# Altium schematic sheet WDT_TASTERI_M_S.SchDoc: ATLAS_XP2V5
size 558 x 431 mm; Organization: IMP Automatika d.o.o.; Revision: V5
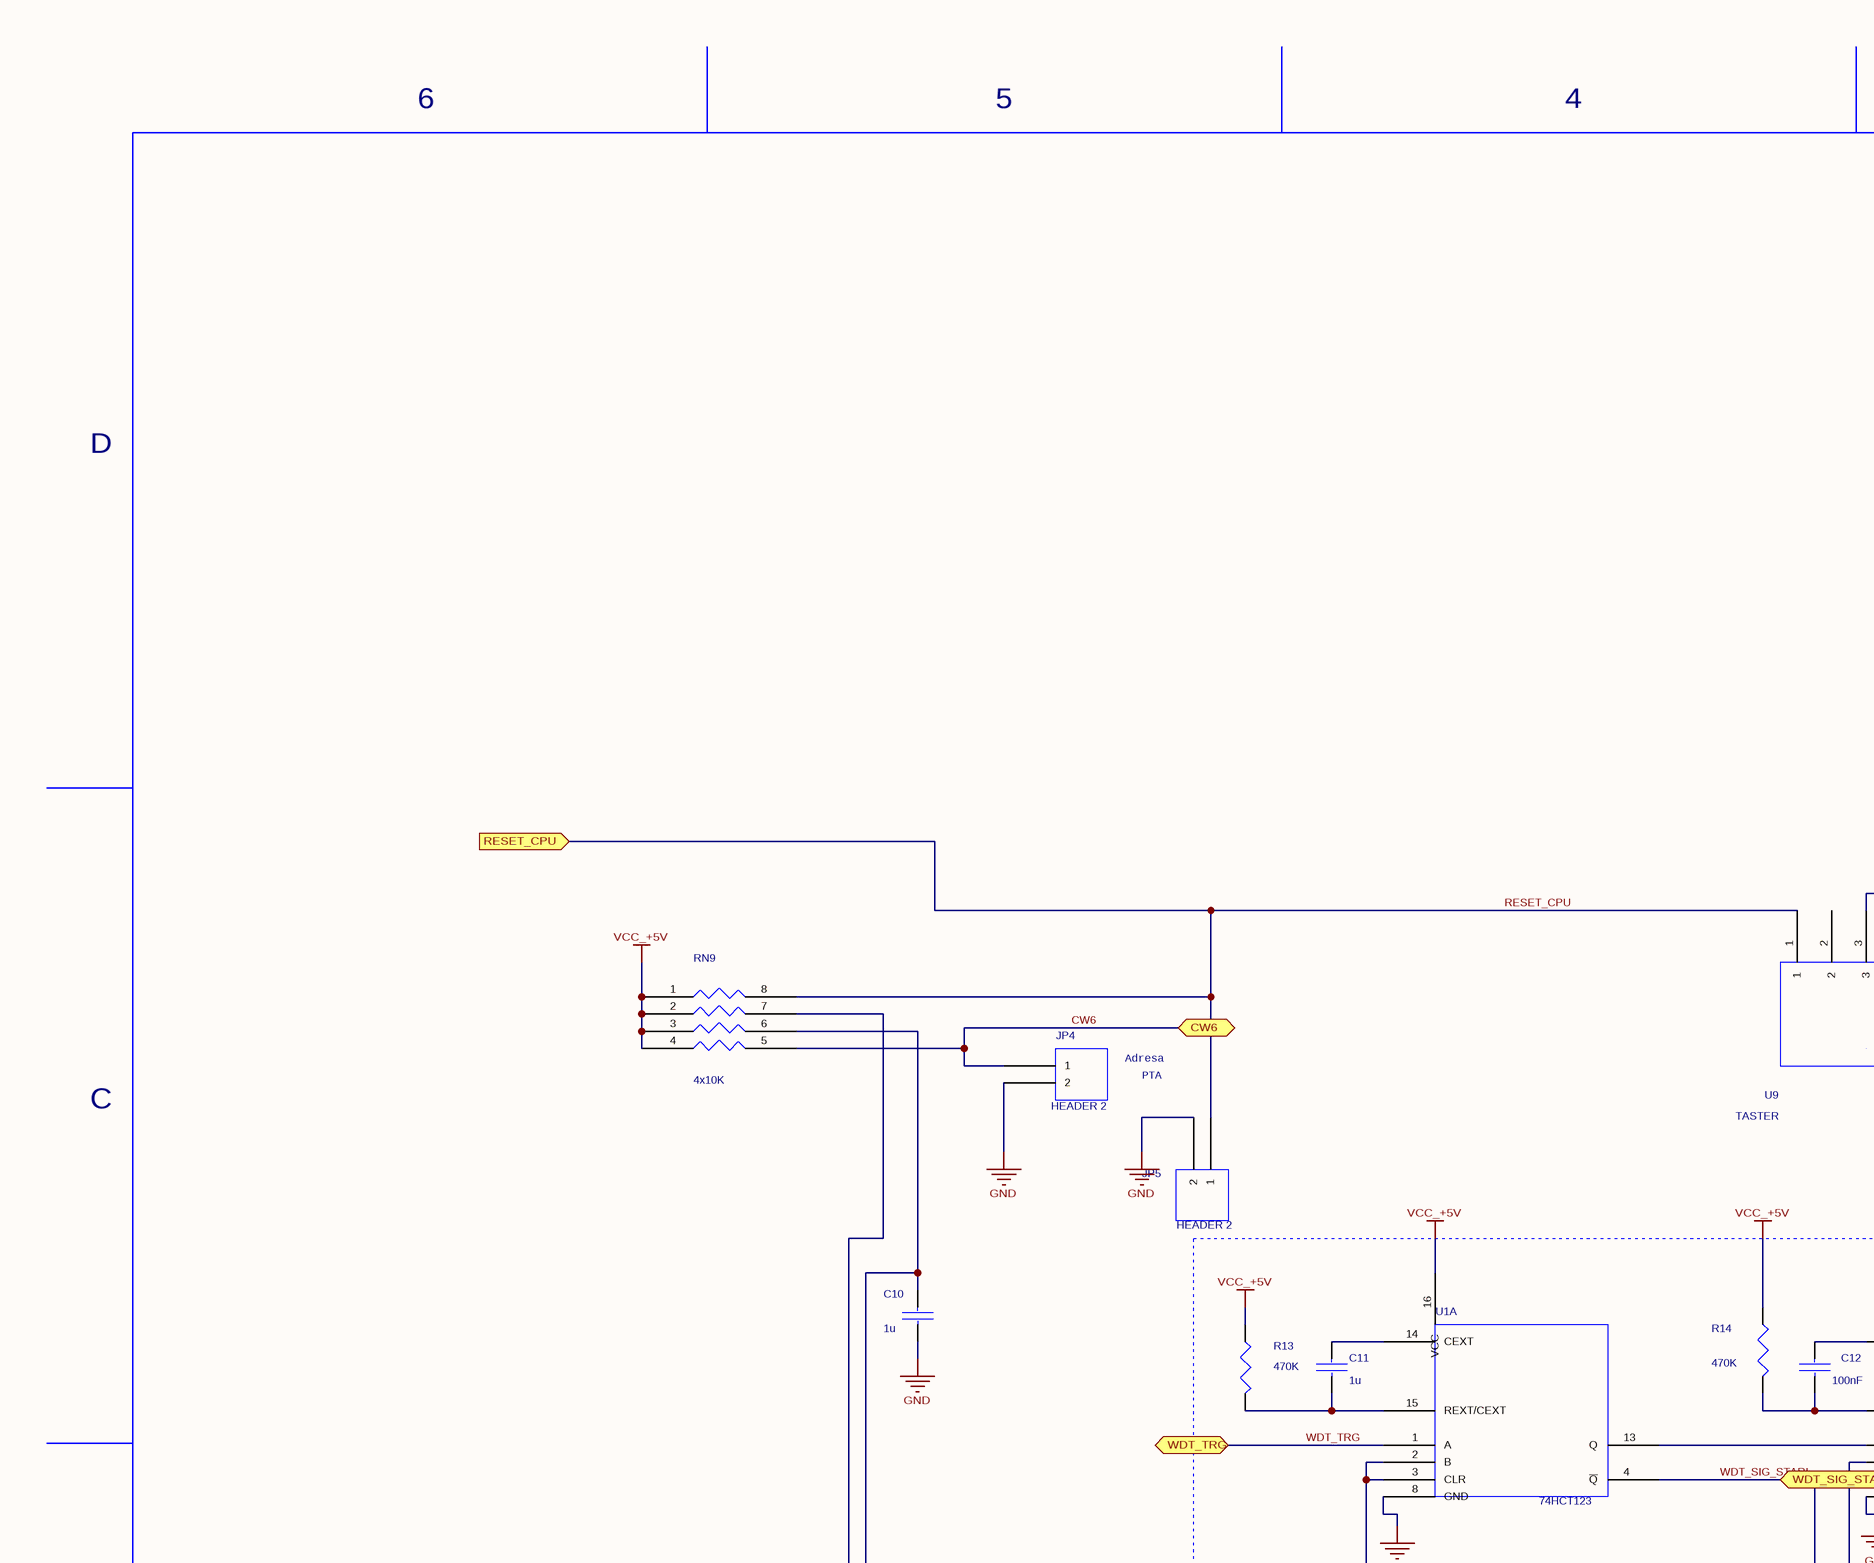
[diagram p0: WDT_TASTERI_M_S.SchDoc, top left]
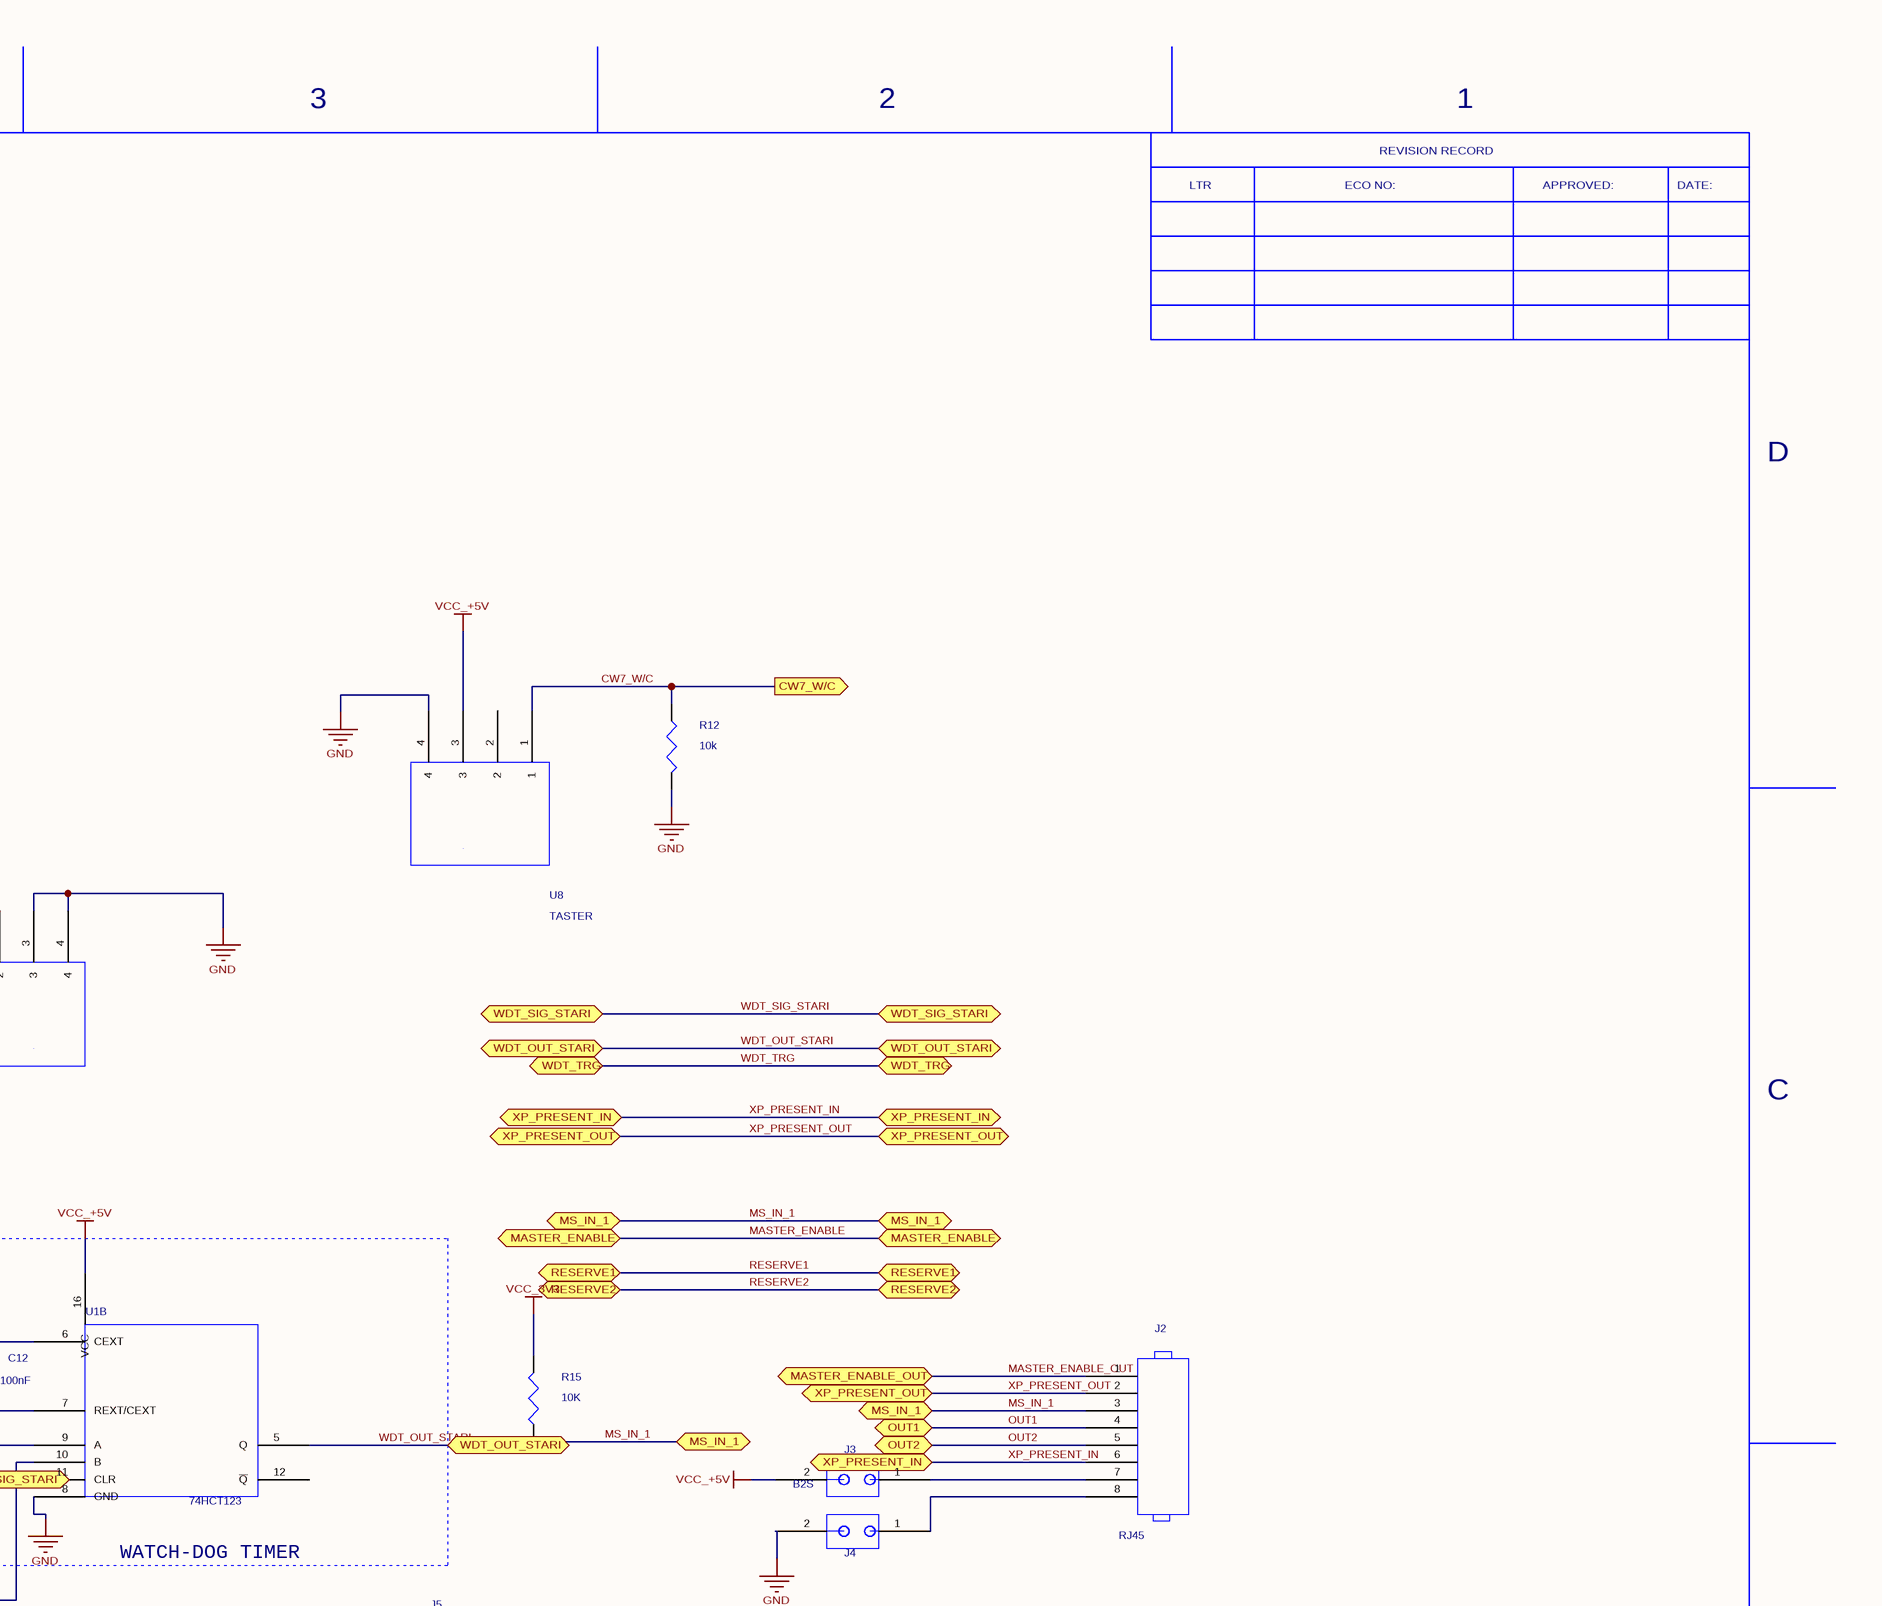
[diagram p1: WDT_TASTERI_M_S.SchDoc, top right]
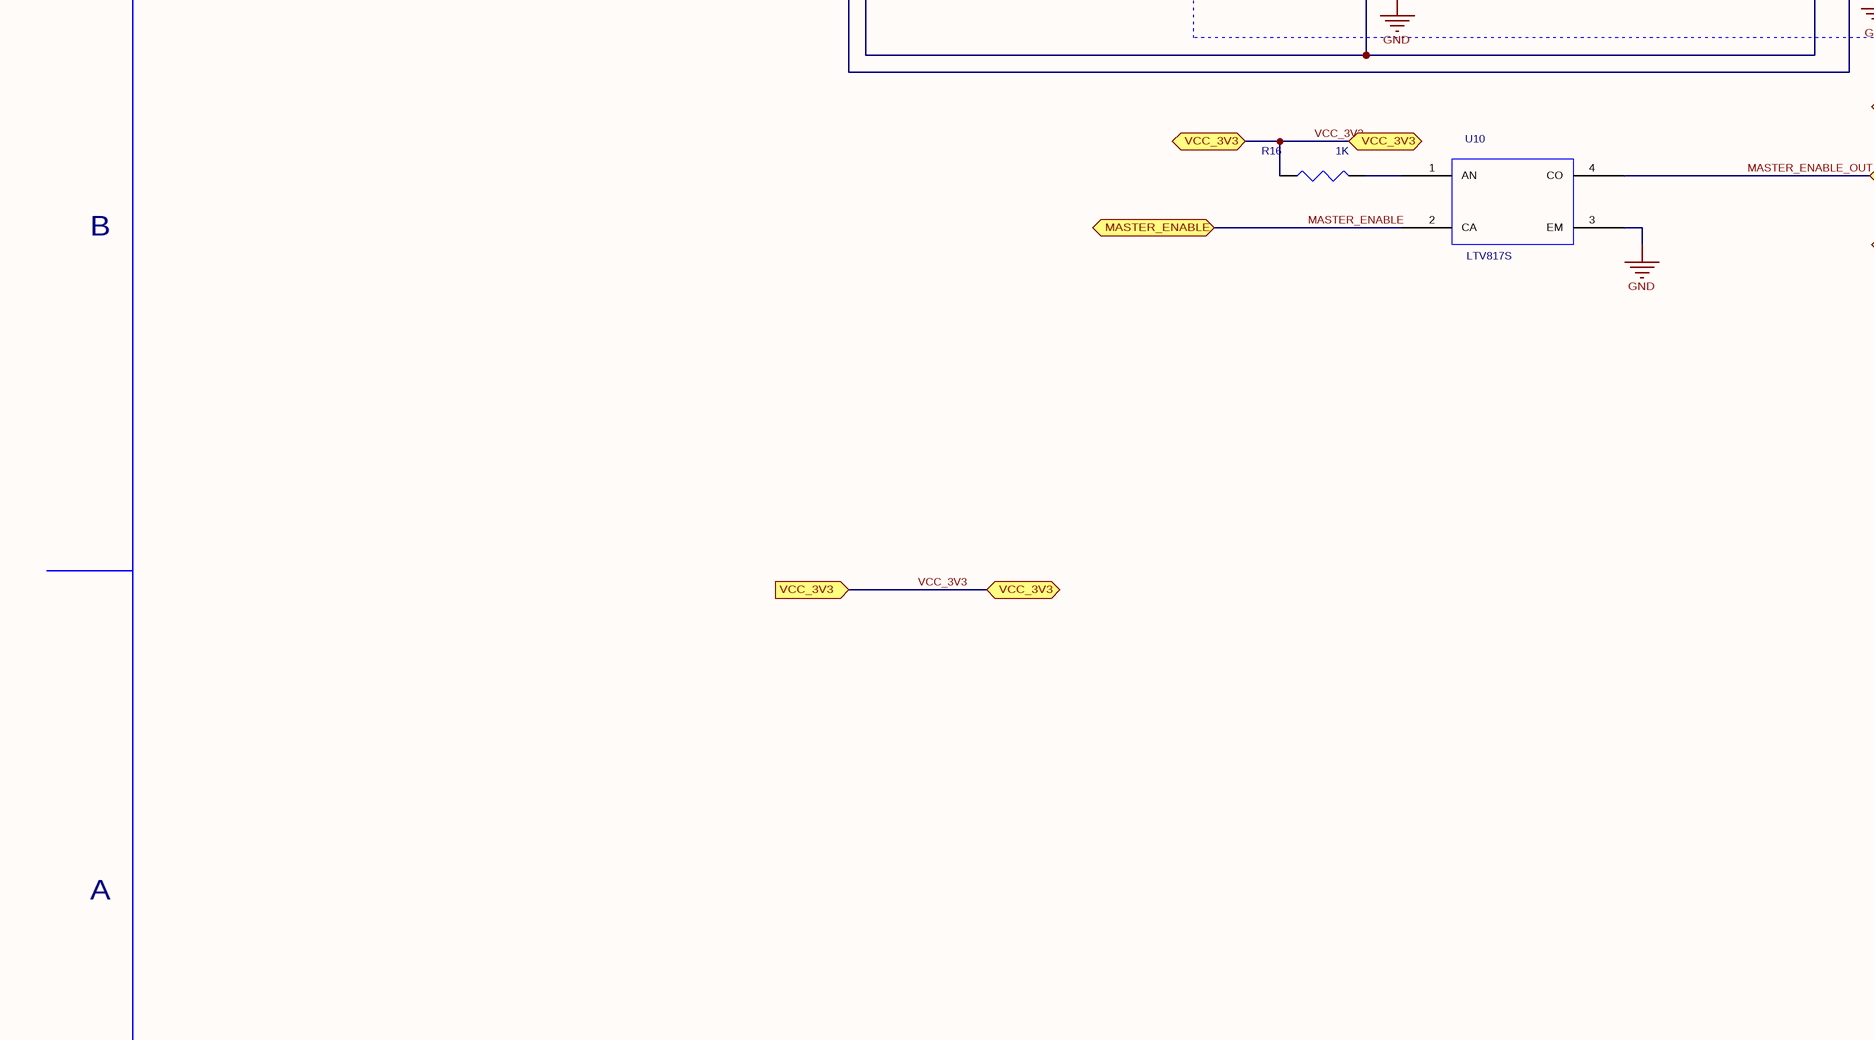
[diagram p2: WDT_TASTERI_M_S.SchDoc, bottom left]
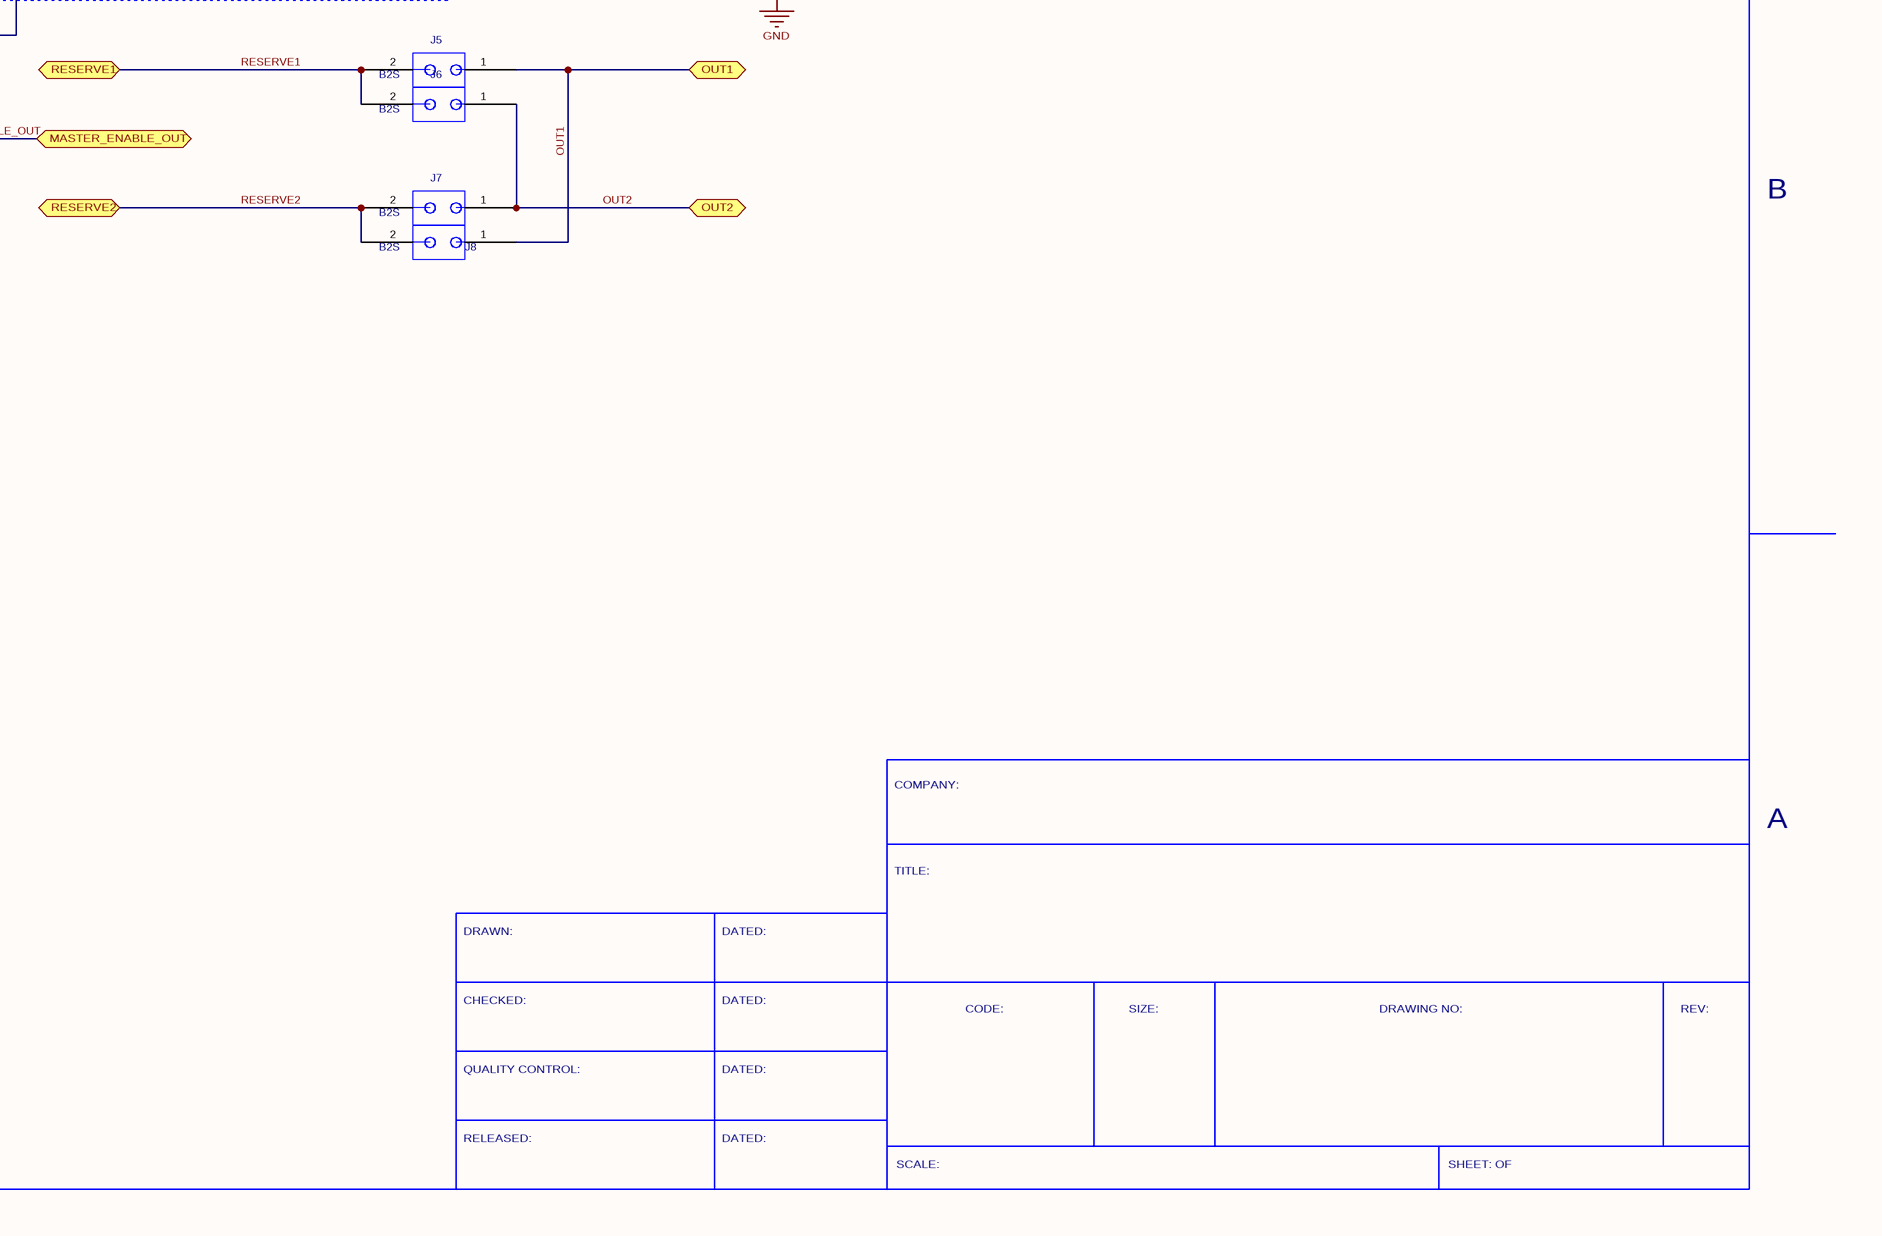
[diagram p3: WDT_TASTERI_M_S.SchDoc, bottom right]

## Parts
C10  value 1u  [SM/C_0805]  (hidden comment: C_2)
C11  value 1u  [SM/C_0805]  (hidden comment: C_2)
C12  value 100nF  [SM/C_0805]  (hidden comment: C_2)
J2  value RJ45  [TELE/TM.420FACE/8X8]  (hidden comment: 8_HEADER)
J3  value B2S  [JUMPER_100]  (hidden comment: B2S_0)
J4  B2S_0  [JUMPER_100]  (value not drawn)
J5  value B2S  [JUMPER_100]  (hidden comment: B2S_0)
J6  value B2S  [JUMPER_100]  (hidden comment: B2S_0)
J7  value B2S  [JUMPER_100]  (hidden comment: B2S_0)
J8  value B2S  [JUMPER_100]  (hidden comment: B2S_0)
JP4  value HEADER 2  [JUMPER_100]  (hidden comment: HEADER_2)
JP5  value HEADER 2  [JUMPER_100]  (hidden comment: HEADER_2)
R12  value 10k  [SM/R_1206]  (hidden comment: RESISTOR_2)
R13  value 470K  [SM/R_1206]  (hidden comment: RESISTOR_2)
R14  value 470K  [SM/R_1206]  (hidden comment: RESISTOR_2)
R15  value 10K  [SM/R_1206]  (hidden comment: RESISTOR_2)
R16  value 1K  [SM/R_1206]  (hidden comment: RESISTOR_2)
RN9  value 4x10K  [SMD_RX4]  (hidden comment: RESAR_IS_4/SM)
U1  value 74HCT123  [SOG.050/16/WG.244/L.375]  (hidden comment: 74HCT123_1)  (parts A,B of 2)
U8  value TASTER  [TP33WW080-SPST_PADS]  (hidden comment: SWITCH_BOJKE)
U9  value TASTER  [TP33WW080-SPST_PADS]  (hidden comment: SWITCH_BOJKE)
U10  value LTV817S  [LTV814S]  (hidden comment: LTV-817)

## Blocks framed on the sheet
WATCH-DOG TIMER: C11 C12 R13 R14 U1

## Ports
CW6 (bidir), CW7_W/C, MASTER_ENABLE (bidir), MASTER_ENABLE_OUT (bidir), MS_IN_1 (bidir), OUT1 (bidir), OUT2 (bidir), RESERVE1 (bidir), RESERVE2 (bidir), RESET_CPU, VCC_3V3, VCC_3V3 (bidir), WDT_OUT_STARI (bidir), WDT_SIG_STARI (bidir), WDT_TRG (bidir), XP_PRESENT_IN (bidir), XP_PRESENT_OUT (bidir)

## Nets
GND: C10.2 J4.2 JP4.2 JP5.2 R12.2 U1.8(GND) U8.4 U9.3 U9.4 U10.3(EM)
VCC_3V3: R15.2 R16.1 ; port VCC_3V3
VCC_+5V: J3.2 R13.1 R14.1 RN9.1 RN9.2 RN9.3 RN9.4 U1.16(VCC) U8.3
CW6: JP4.1 RN9.5 ; port CW6
CW7_W/C: R12.1 U8.1 ; port CW7_W/C
MASTER_ENABLE: U10.2(CA) ; port MASTER_ENABLE
MASTER_ENABLE_OUT: J2.1 U10.4(CO) ; port MASTER_ENABLE_OUT
MS_IN_1: J2.3 R15.1 ; port MS_IN_1
OUT1: J2.4 J5.1 J8.1 ; port OUT1
OUT2: J2.5 J6.1 J7.1 ; port OUT2
RESERVE1: J5.2 J6.2 ; port RESERVE1
RESERVE2: J7.2 J8.2 ; port RESERVE2
RESET_CPU: JP5.1 RN9.8 U9.1 ; port RESET_CPU
WDT_OUT_STARI: U1.5(Q) ; port WDT_OUT_STARI
WDT_SIG_STARI: U1.4(~{Q}) ; port WDT_SIG_STARI
WDT_TRG: U1.1(A) ; port WDT_TRG
XP_PRESENT_IN: J2.6 ; port XP_PRESENT_IN
XP_PRESENT_OUT: J2.2 ; port XP_PRESENT_OUT
NetC10_1: C10.1 RN9.6 U1.2(B) U1.3(CLR) U1.11(CLR)
NetC11_1: C11.1 U1.14(CEXT)
NetC11_2: C11.2 R13.2 U1.15(REXT/CEXT)
NetC12_1: C12.1 U1.6(CEXT)
NetC12_2: C12.2 R14.2 U1.7(REXT/CEXT)
NetJ2_7: J2.7 J3.1
NetJ2_8: J2.8 J4.1
NetR16_2: R16.2 U10.1(AN)
NetRN9_7: RN9.7 U1.10(B)
NetU1_9: U1.9(A) U1.13(Q)

Not connected (* = marked no-connect by the designer): U1 12(~{Q}); U8 2; U9 2

## Notes on the sheet
- 6
- 5
- 4
- 3
- 2
- 1
- LTR
- ECO NO:
- REVISION RECORD
- APPROVED:
- DATE:
- D
- Adresa
- C
- PTA
- B
- COMPANY:
- A
- TITLE:
- DRAWN:
- DATED:
- CHECKED:
- CODE:
- SIZE:
- DRAWING NO:
- REV:
- QUALITY CONTROL:
- RELEASED:
- SCALE:
- SHEET: OF

## Library data of the parts
C10-C12 = C_2: Source_Path: D:\ORCADWIN\CAPTURE\PTA\PC2A_00.OLB; SDTSourceLibName: C:\WINDOWS\TEMP\PC2A_00.LIB; PCB DECAL: SM/C_0805
J2 = 8_HEADER: Source_Path: C:\CADENCE\PSD_15.1\TOOLS\CAPTURE\LIBRARY\CONNECTOR.OLB; PCB DECAL: TELE/TM.420FACE/8X8
J3 J5-J8 = B2S_0: Source_Path: C:\CADENCE\PSD_15.1\TOOLS\ATLAS_ITA\ATLAS_ITA.DSN; PCB DECAL: JUMPER_100
J4 = B2S_0: Source_Path: C:\CADENCE\PSD_15.1\TOOLS\ATLAS_ITA\ATLAS_ITA.DSN; Value: B2S; PCB DECAL: JUMPER_100
JP4 JP5 = HEADER_2: Source_Path: D:\ORCADWIN\CAPTURE\PTA\PC2A_00.OLB; SDTSourceLibName: C:\WINDOWS\TEMP\PC2A_00.LIB; PCB DECAL: JUMPER_100
R12-R16 = RESISTOR_2: Source_Path: C:\CADENCE\PSD_15.1\TOOLS\CAPTURE\LIBRARY\DISCRETE.OLB; PCB DECAL: SM/R_1206
RN9 = RESAR_IS_4/SM: Source_Path: C:\ORCAD\ORCAD_10.5\TOOLS\CAPTURE\LIBRARY\DISCRETE.OLB; PCB DECAL: SMD_RX4
U1 = 74HCT123_1: Source_Path: E:\MILOS\PROJECTS\ATLAS_XP\ATLAS_XP.DSN; SDTSourceLibName: C:\WINDOWS\TEMP\PC2A_00.LIB; PCB DECAL: SOG.050/16/WG.244/L.375
U8 = SWITCH_BOJKE: CW_TASTER; Source_Path: C:\CADENCE\PSD_15.1\TOOLS\ATLAS_ITA\LIBRARY1.OLB; Serial No: TP33WW080; Geometry.Height: 8.65mm; PCB DECAL: TP33WW080-SPST_PADS
U9 = SWITCH_BOJKE: RST_TASTER; Source_Path: C:\CADENCE\PSD_15.1\TOOLS\ATLAS_ITA\LIBRARY1.OLB; Serial No: TP33WW080; Geometry.Height: 8.65mm; PCB DECAL: TP33WW080-SPST_PADS
U10 = LTV-817: Source_Path: C:\PROJECTS\ATLAS_XP\LIBRARY1.OLB; PCB DECAL: LTV814S